# EAGLE design color_sensor_node (EAGLE 9.2.0)
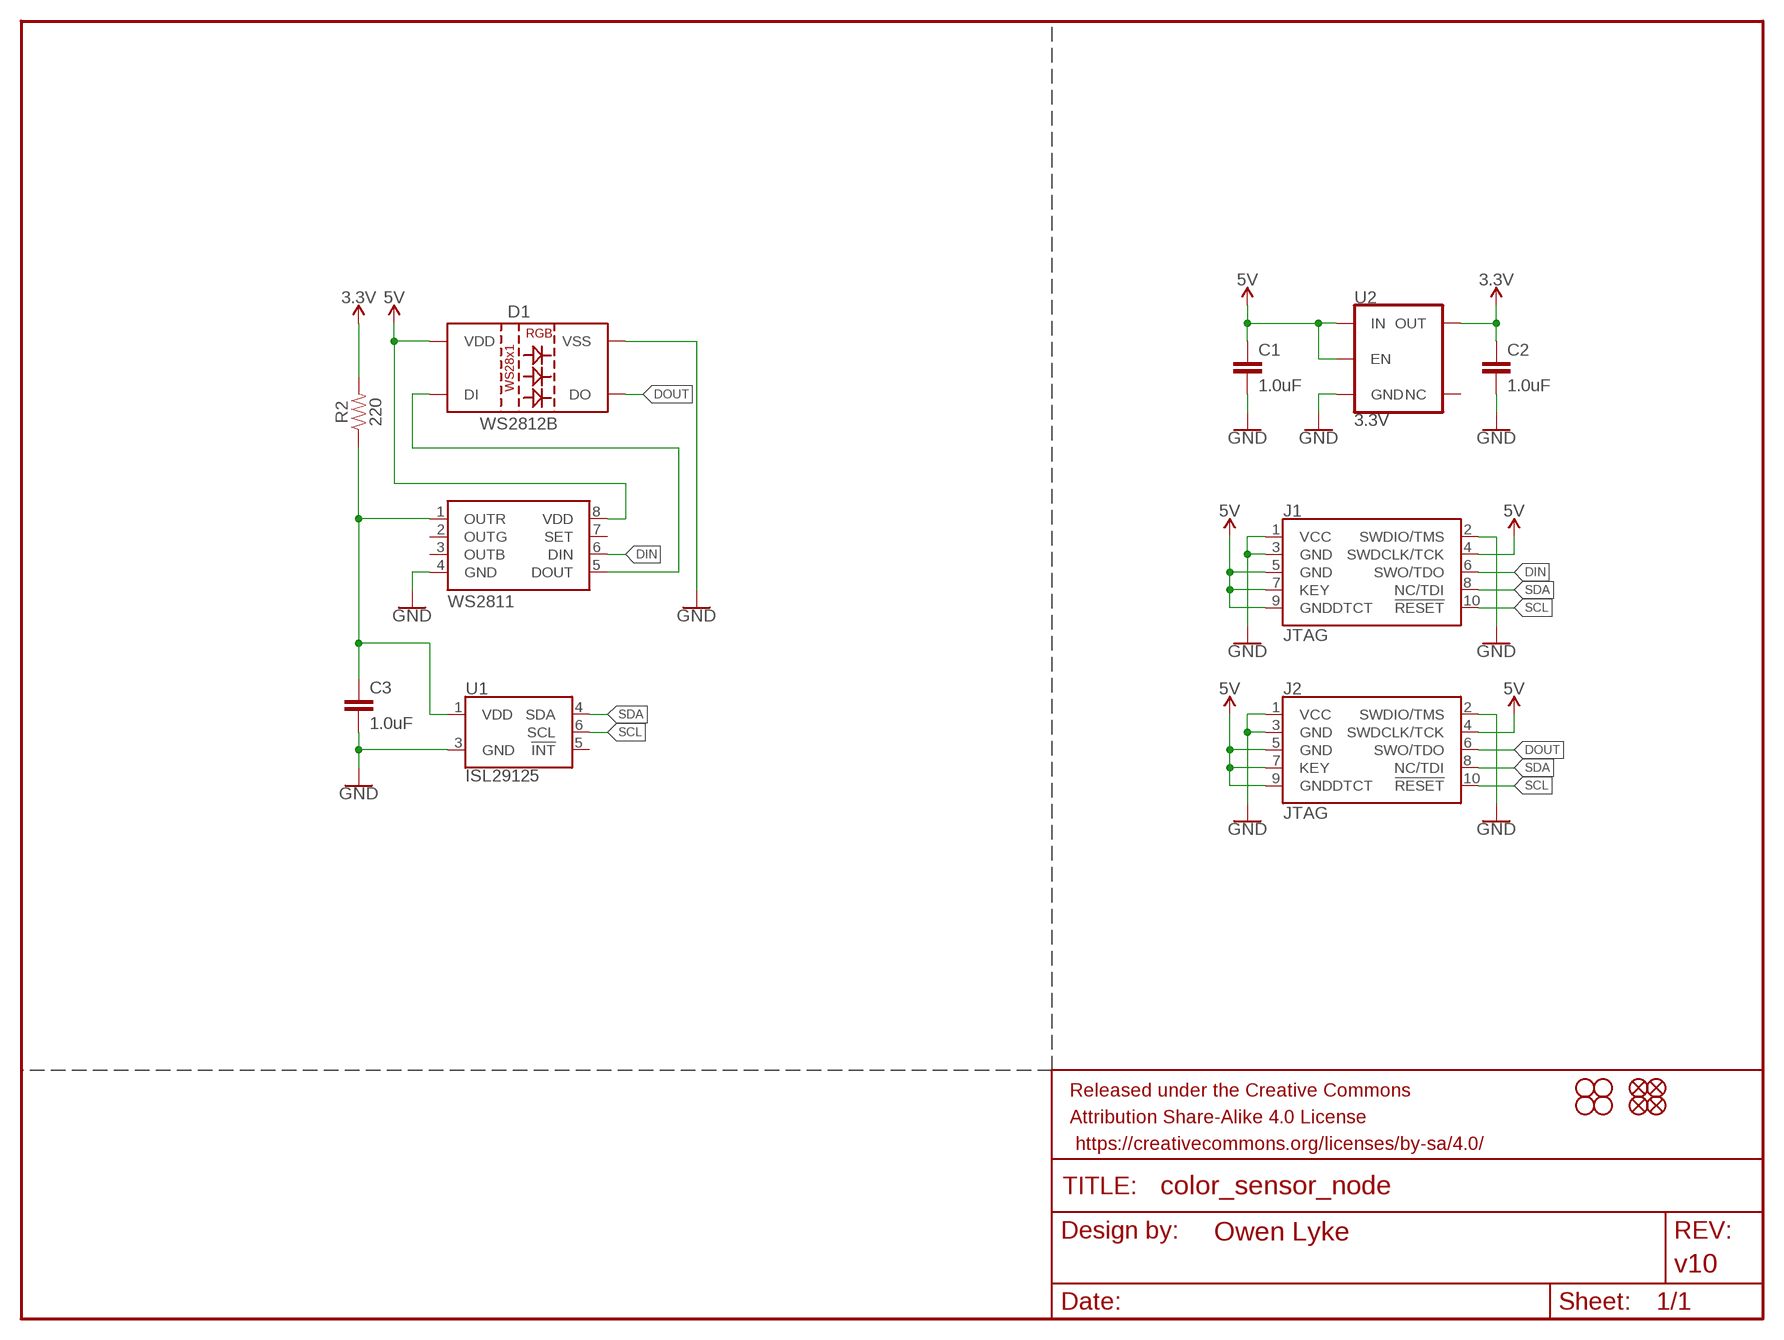
[diagram p0: schematic, sheet 1]

## Parts
C1  1.0uF  1.0UF-0603-16V-10%  [0603]
C2  1.0uF  1.0UF-0603-16V-10%  [0603]
C3  1.0uF  1.0UF-0603-16V-10%  [0603]
D1  WS2812B  WS2812-2020  [WS2812-2020]
FD1  FIDUCIAL1X2  [FIDUCIAL-1X2]
FD2  FIDUCIAL1X2  [FIDUCIAL-1X2]
FD3  FIDUCIAL1X2  [FIDUCIAL-1X2]
FD4  FIDUCIAL1X2  [FIDUCIAL-1X2]
FRAME1  FRAME-LETTER  [CREATIVE_COMMONS]
H1  STAND-OFF#8  [STAND-OFF-#8]
H2  STAND-OFF#8  [STAND-OFF-#8]
H3  STAND-OFF#8  [STAND-OFF-#8]
H4  STAND-OFF#8  [STAND-OFF-#8]
J1  JTAG  CORTEX_JTAG_DEBUG_SMD  [2X5-SMD-1.27MM]
J2  JTAG  CORTEX_JTAG_DEBUG_SMD  [2X5-SMD-1.27MM]
R2  220  220OHM-0603-1/10W-1%  [0603]
U1  ISL29125  [ODFN-6]
U2  3.3V  V_REG_AP2112K-3.3V  [SOT23-5]
U3  WS2811  [SOIC-8]

## Nets
3.3V: C2.1 R2.2 U2.5(OUT)
5V: C1.1 D1.4(VDD) J1.4(SWDCLK/TCK) J1.5(GND) J1.7(KEY) J1.9(GNDDTCT) J2.4(SWDCLK/TCK) J2.5(GND) J2.7(KEY) J2.9(GNDDTCT) U2.1(IN) U2.3(EN) U3.8(VDD)
DIN: J1.6(SWO/TDO) U3.6(DIN)
DOUT: D1.1(DO) J2.6(SWO/TDO)
GND: C1.2 C2.2 C3.2 D1.2(VSS) J1.1(VCC) J1.2(SWDIO/TMS) J1.3(GND) J2.1(VCC) J2.2(SWDIO/TMS) J2.3(GND) U1.3(GND) U2.2(GND) U3.4(GND)
N$2: C3.1 R2.1 U1.1(VDD) U3.1(OUTR)
N$4: D1.3(DI) U3.5(DOUT)
SCL: J1.10(!RESET) J2.10(!RESET) U1.6(SCL)
SDA: J1.8(NC/TDI) J2.8(NC/TDI) U1.4(SDA)
Unconnected: U1.5(!INT) U2.4(NC) U3.2(OUTG) U3.3(OUTB) U3.7(SET)

## Library data of the parts
C1-C3 = SparkFun-Capacitors:1.0UF: 1µF ceramic capacitors A capacitor is a passive two-terminal electrical component used to store electrical energy temporarily in an electric field.; PROD_ID: CAP-00868
D1 = SparkFun-LED:WS2812-2020
FD1-FD4 = SparkFun-Aesthetics:FIDUCIAL: Fiducial Alignment Points Point-of-reference for pick-and-place machines and other optical instruments.
FRAME1 = SparkFun-Aesthetics:FRAME-LETTER: Schematic Frame - Letter Standard 8.5x11 US Letter frame; DESIGNER: Owen Lyke; REV: v10
H1-H4 = standoff:STAND-OFF: Stand Off Drill holes for mechanically mounting via screws, standoffs, etc. Note: Use the keepout ring to avoid running the screw head into surrounding components. Variant Overviews STAND-OFF - Mechanical footprint for a #4 phillips button head screw. STAND-OFF-TIGHT - Mechanical footprint for a #4 phillips button head screw, Example SparkFun Products Screw - Phillips Head (1/4", 4-40, 10 pack) <https://www.sparkfun.com/products/10453> (PRT-10453) Screw - Phillips Head (1/2", 4-40, 10 pack) <https://www.sparkfun.com/products/10452> (PRT-10452) Screw - Phillips Head (3/4", 4-40, 10 pack) <https://www.sparkfun.com/products/10451> (PRT-10451) Screw - Phillips Head (1", 4-40, 10 pack) <https://www.sparkfun.com/products/10450> (PRT-10450)
J1 J2 = SparkFun-Connectors:CORTEX_JTAG_DEBUG: Cortex Debug Connector - 10 pin Supports JTAG debug, Serial Wire debug, and Serial Wire Viewer. PTH and SMD connector options available. General Connector Information <http://infocenter.arm.com/help/topic/com.arm.doc.faqs/attached/13634/cortex_debug_connectors.pdf> Products: PTH Connector <http://www.digikey.com/product-detail/en/cnc-tech/3220-10-0100-00/1175-1627-ND/3883661> -via Digi-Key SparkFun PSoc <https://www.sparkfun.com/products/13229> SparkFun T <https://www.sparkfun.com/products/13810>; PROD_ID: CONN-14503
R2 = SparkFun-Resistors:220OHM: 220Ω resistor A resistor is a passive two-terminal electrical component that implements electrical resistance as a circuit element. Resistors act to reduce current flow, and, at the same time, act to lower voltage levels within circuits. - Wikipedia; PROD_ID: RES-07861
U1 = SparkFun-Sensors:ISL29125: Intersil ISL29125 RGB Color Light Sensor The ISL29125 is a low power, high sensitivity, RED, GREEN and BLUE color light sensor (RGB) with an I2C (SMBus compatible) interface. Its state-of-the-art photodiode array provides an accurate RGB spectral response and excellent light source to light source variation (LS2LS). Datasheet <https://cdn.sparkfun.com/datasheets/Sensors/LightImaging/isl29125.pdf> SparkFun Products SparkFun RGB Light Sensor - ISL29125 <https://www.sparkfun.com/products/12829> (SEN-12829); PROD_ID: IC-12055
U2 = SparkFun-IC-Power:V_REG_AP2112: AP2112 - 600mA CMOS LDO Regulator w/ Enable The AP2112 is CMOS process low dropout linear regulator with enable function, the regulator delivers a guaranteed 600mA (min.) continuous load current. Features Output Voltage Accuracy: ±1.5% Output Current: 600mA (Min.) Foldback Short Current Protection: 50mA Enable Function to Turn ON/OFF VOUT Low Dropout Voltage (3.3V): 250mV (Typ.) @IOUT=600mA Excellent Load Regulation: 0.2%/A (Typ.) Excellent Line Regulation: 0.02%/V (Typ.) Low Quiescent Current: 55μA (Typ.) Low Standby Current: 0.01μA (Typ.) Low Output Noise: 50μVRMS PSRR: 100Hz -65dB, 1kHz -65dB OTSD Protection Stable with 1.0μF Flexible Cap: Ceramic, Tantalum and Aluminum Electrolytic Operation Temperature Range: -40°C to 85°C ESD: MM 400V, HBM 4000V; PROD_ID: VREG-12457
U3 = ws2811:WS2811

## Board
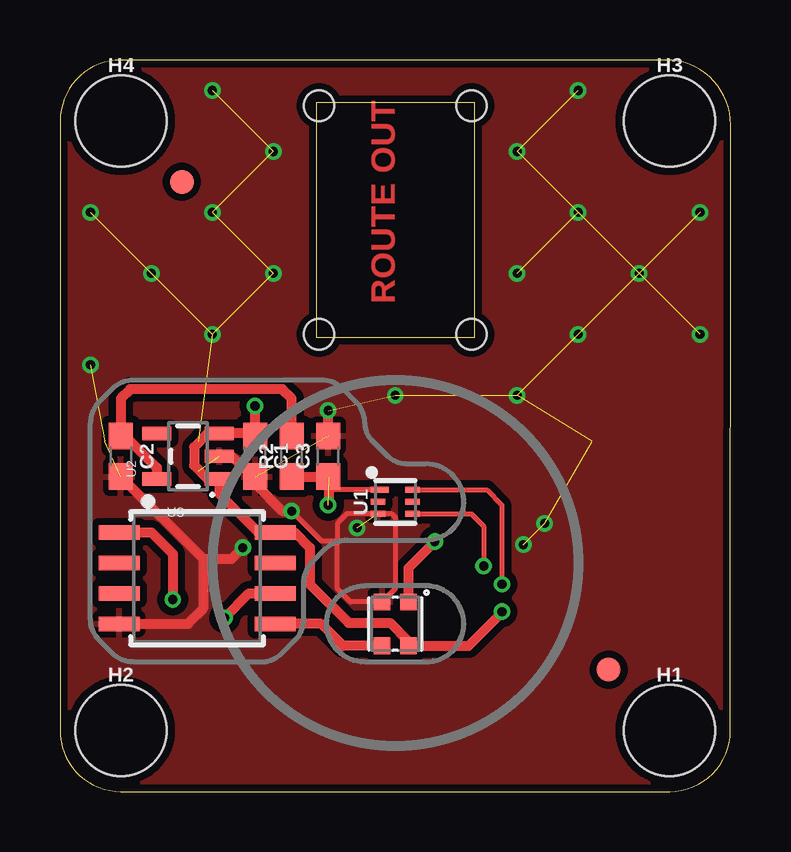
[diagram p1: board, top side]
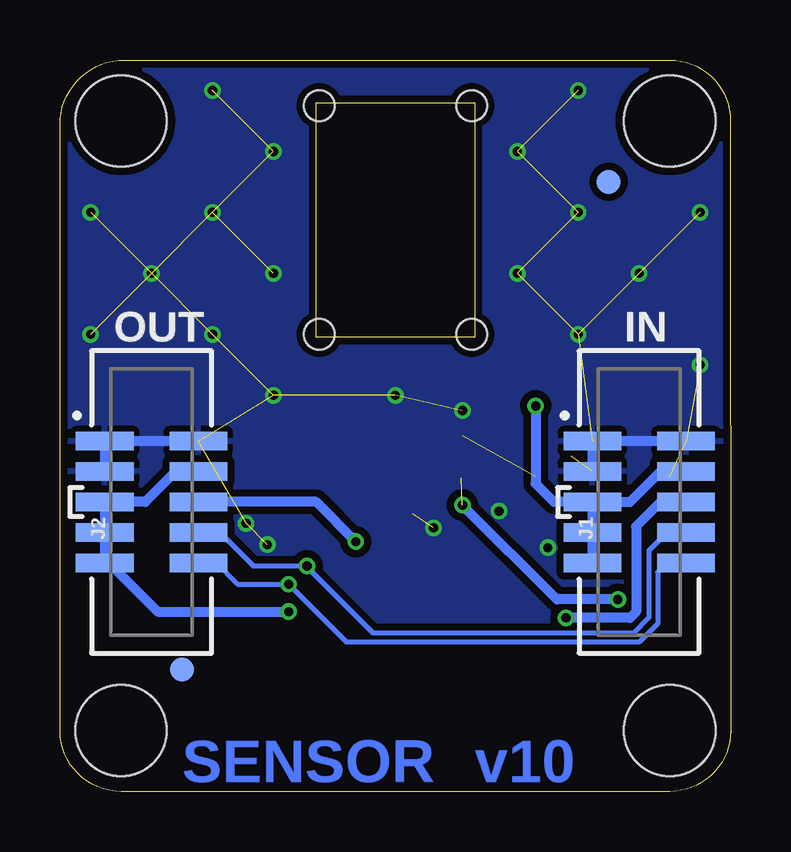
[diagram p2: board, bottom side, seen from below]

Size 27.94 x 30.48 mm. Coordinates in mm from the lower left corner, seen from the top.
Outline: 0.01,27.95 0,2.54 arc90 2.54,0 25.4,0 arc90 27.94,2.53 27.94,27.79 arc90 25.26,30.48 2.54,30.48 arc90 0.01,27.95
Outline: 10.67,28.7 10.67,18.92 17.27,18.92 17.27,28.7 10.67,28.7
Copper layers (1*16): Top 0.035mm / dielectric 1.5mm / Bottom 0.035mm
Design rules "SparkFun-2-layer-PCBWay-LIMIT": minimum track width 6mil, minimum drill 0.3mm, track to track 6mil, track to pad 6mil, pad to pad 6mil, via to via 6mil, smd to smd 6mil, copper to edge 6mil, drill to drill 6mil, minimum pad ring 6mil, minimum via ring 6mil, stop-mask expansion 4mil, vias tented up to drill 25mil, thermal gap 10mil
Holes 1.27 mm at 10.79,28.57 17.14,28.57 10.79,19.05 17.14,19.05

### Footprints (pad centres in the part's own frame; a part is rotated, then mirrored left to right if it is on the bottom)
0603 = smd 1.1 x 1: 1 -0.85,0; 2 0.85,0
WS2812-2020 = smd 0.7 x 0.7: 1 0.915,-0.55; 2 0.915,0.55; 3 -0.915,0.55; 4 -0.915,-0.55
FIDUCIAL-1X2 = smd 1 x 1: 1 0,0
STAND-OFF-#8 = hole 3.81: 0,0
2X5-SMD-1.27MM = smd 0.76 x 2.4: 1 2.54,1.95; 2 2.54,-1.95; 3 1.27,1.95; 4 1.27,-1.95; 5 0,1.95; 6 0,-1.95; 7 -1.27,1.95; 8 -1.27,-1.95; 9 -2.54,1.95; 10 -2.54,-1.95
ODFN-6 = smd 0.75 x 0.25: 1 -0.645,0.5 | smd 0.6 x 0.25: 2 -0.72,0; 3 -0.72,-0.5; 4 0.72,-0.5; 5 0.72,0; 6 0.72,0.5
SOT23-5 = smd 0.55 x 1.2: 1 -0.95,-1.3; 2 0,-1.3; 3 0.95,-1.3; 4 0.95,1.3; 5 -0.95,1.3
SOIC-8 = smd 0.61 x 1.702: 1 -1.905,-3.251; 2 -0.635,-3.251; 3 0.635,-3.251; 4 1.905,-3.251; 5 1.905,3.251; 6 0.635,3.251; 7 -0.635,3.251; 8 -1.905,3.251

### Placement (x,y rotation side)
C1  8.13,13.97 270 top
C2  2.54,13.97 270 top
C3  11.18,13.97 90 top
D1  13.97,6.99 90 top
FD1  5.08,25.4 0 top
FD2  22.86,5.08 0 top
FD3  5.08,25.4 0 bottom
FD4  22.86,5.08 0 bottom
FRAME1  -5.08,-8.89 0 top  (outside the outline)
H1  25.4,2.54 0 top
H2  2.54,2.54 0 top
H3  25.4,27.94 0 top
H4  2.54,27.94 0 top
J1  3.81,12.06 90 bottom
J2  24.13,12.06 90 bottom
R2  9.65,13.97 90 top
U1  13.97,12.06 0 top
U2  5.33,13.97 90 top
U3  5.71,8.89 270 top

### Tracks (layer width: path | path; a pad name or v marks a point on that pad's centre or on a via)
3.3V
  Top 0.406: R2.2 9.65,16.38 9.27,16.76 2.92,16.76 2.54,16.38 C2.1 2.71,14.82 4.03,13.49 U2.5
5V  (via drill 0.38)
  Top 0.406: v8.13,16.07 C1.1 8.03,14.92 U2.3 6.16,14.92 5.59,14.35 5.59,13.59 6.16,13.02 U2.1 6.63,12.42 8.25,10.79 U3.8 9.78,10.79 10.41,10.16 10.41,8.64 12.02,7.03 13.76,7.03 14.52,6.26 D1.4 17.03,6.07 18.41,7.46 v18.41,7.49
  Bottom 0.406: J1.5 J1.7 J1.9 | J2.4 23.11,13.34 24.38,12.06 J2.5 J2.7 J2.9 25.91,9.53 23.88,7.49 v18.41,7.49 | J1.4 2.92,13.34 4.19,12.06 J1.5 | v8.13,16.07 8.13,12.83 7.37,12.06 J1.5
DIN  (via drill 0.38)
  Top 0.406: v6.86,7.24 7.87,8.26 U3.6
  Bottom 0.406: J1.6 2.92,12.06 3.94,11.05 3.94,7.49 4.19,7.24 v6.86,7.24
DOUT  (via drill 0.38)
  Top 0.406: v15.62,10.41 14.52,9.31 D1.1
  Bottom 0.406: v15.62,10.41 17.27,12.06 J2.6
GND  (via drill 0.38)  (25 unrouted)
  Top 0.203: v9.65,11.68 10.9,10.44 11.56,10.44 | 11.56,10.44 11.56,11.18 11.95,11.56 U1.3 13.83,11.56 13.97,11.43 13.97,8.45 D1.2 12.1,7.9 11.56,8.44 11.56,10.44
  Top 0.406: U2.2 7.15,13.97 8,13.12 C1.2 8.13,12.83 9.27,11.68 v9.65,11.68 | C3.2 v11.18,15.88 | 5.97,9.69 C2.2 | U3.4 5.33,6.99 5.97,7.62 5.97,9.69 | 5.97,9.69 7.15,9.69 v7.62,10.16
  Bottom 0.406: J2.2 J2.1 J2.3 | J1.2 J1.1 J1.3
  other vias: 6.35,29.21 21.59,29.21 8.89,26.67 19.05,26.67 1.27,24.13 3.81,21.59 6.35,24.13 8.89,21.59 1.27,17.78 6.35,19.05 13.97,16.51 19.05,16.51 19.05,21.59 21.59,24.13 24.13,21.59 26.67,24.13 21.59,19.05 26.67,19.05 12.38,10.99 19.3,10.29 20.19,11.18
  pour Bottom (isolate 0.305): 25.4,0 2.54,0 arc-90 0,2.54 0,27.94 arc-90 2.54,30.48 25.4,30.48 arc-90 27.94,27.94 27.94,2.54 arc-90
  pour Top (isolate 0.305, rank 2): 25.4,0 2.54,0 arc-90 0,2.54 0,27.94 arc-90 2.54,30.48 25.4,30.48 arc-90 27.94,27.94 27.94,2.54 arc-90
N$2  (via drill 0.38)  (1 unrouted)
  Top 0.203: U1.1 11.22,12.56 | 11.22,13.07 C3.1
  Top 0.406: R2.1 C3.1 | U3.1 3.81,10.79 4.7,9.91 v4.7,8 | v11.18,11.94 11.22,11.98 11.22,12.56
  Bottom 0.406: v4.7,8 7.24,8 v11.18,11.94
N$4
  Top 0.406: D1.3 11.8,6.07 10.89,6.99 U3.5
SCL  (via drill 0.38)
  Top 0.203: U1.6 17.78,12.56 18.41,11.93 v18.41,8.64
  Bottom 0.203: J2.10 21.42,9.53 20.53,8.64 v18.41,8.64 16,6.22 3.81,6.22 3.05,6.99 3.05,9.14 2.67,9.53 J1.10
SDA  (via drill 0.38)
  Top 0.203: U1.4 17.14,11.56 17.65,11.06 v17.65,9.4
  Bottom 0.203: J2.8 21.29,10.79 19.89,9.4 v17.65,9.4 17.65,9.37 14.88,6.6 4.06,6.6 3.4,7.26 3.4,10.03 2.64,10.79 J1.8

### Text on the board
Top: ROUTE OUT
Bottom: v10 | SENSOR
bPlace: IN | OUT